# Altium schematic sheet MCH_FPGA_Bank_0_CFG.SchDoc: Metlino
size 420 x 297 mm; CheckedBy: P.Kulik,T.Przywozki,W.Ruclo; Author: G.Kasprowicz; CompanyName: WUT ISE; DrawnBy: G.Kasprowicz; Organization: WUT ISE; Address1: PW ISE; Address2: Nowowiejska 15/19 00-665 Warsaw; Address3: gkasprow@gmail.com; DocumentNumber: 2; Revision: 2; SheetNumber: 2; SheetTotal: 29; ModifiedBy: -; CheckedDate: -; Title2: FPGA Bank0 & configuration; DivGrp: WUT ISE; Designer: G.Kasprowicz; ModifiedDate: -; ProjectName: Sensor Box
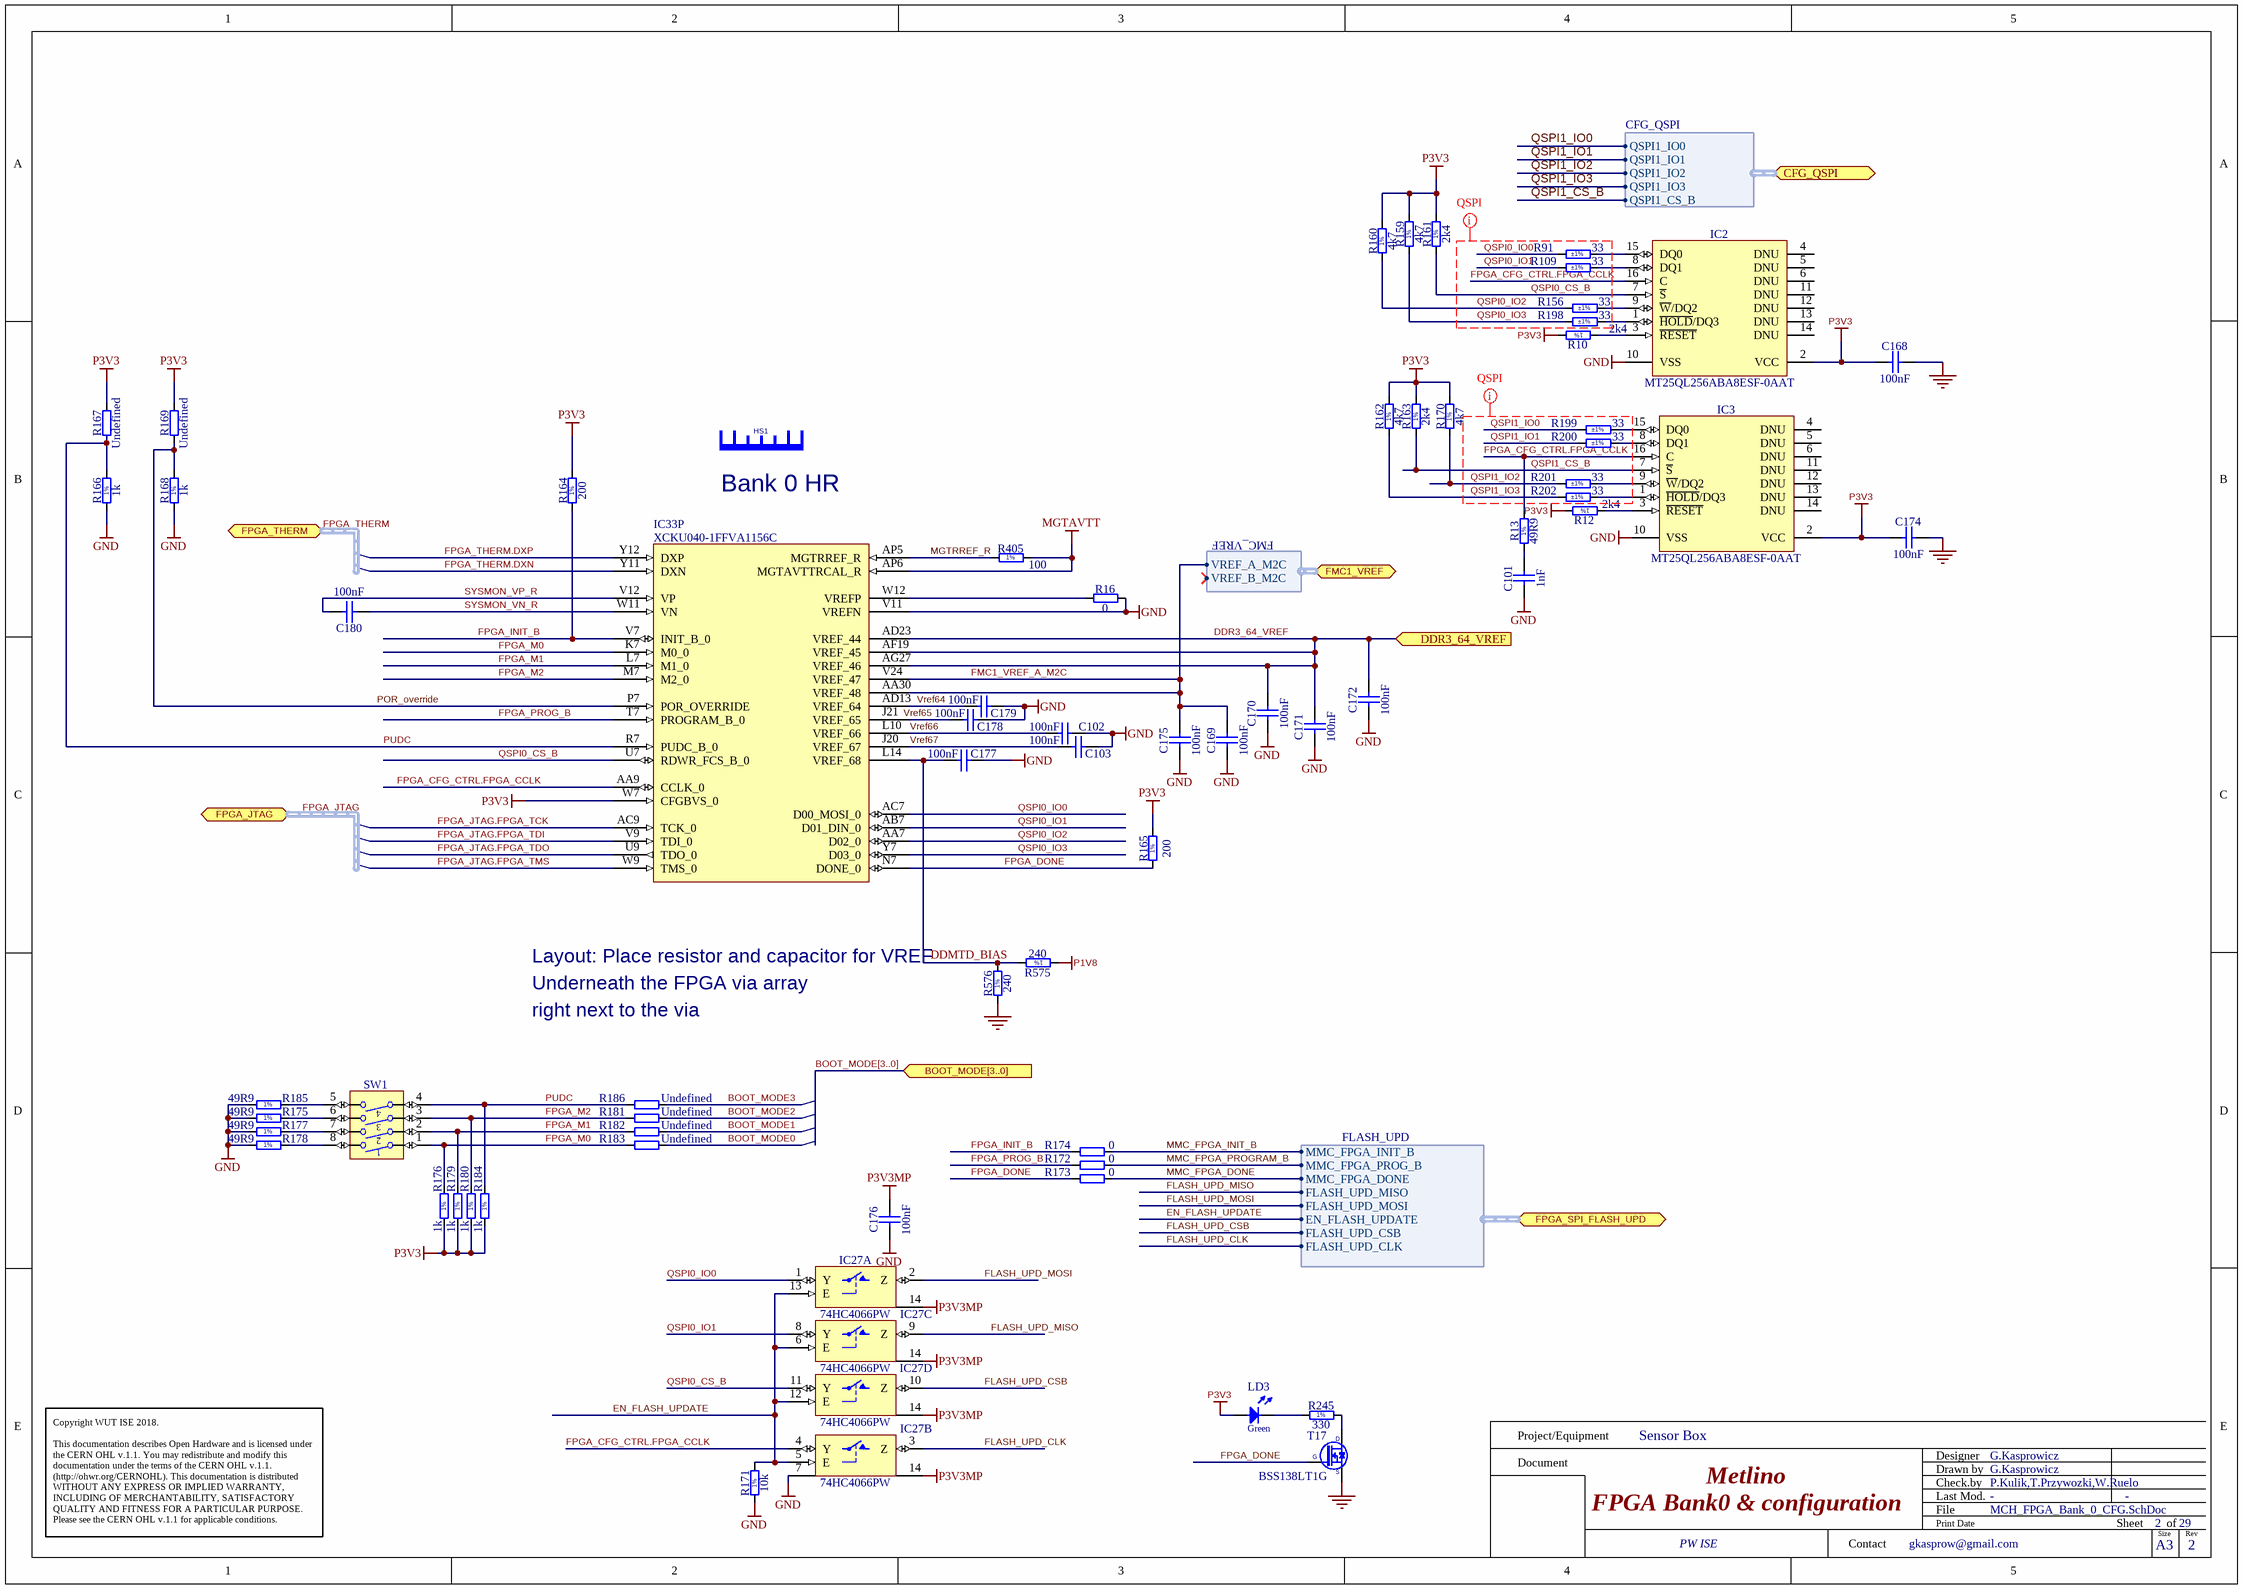
[diagram p0: MCH_FPGA_Bank_0_CFG.SchDoc]

## Parts
C101  1nF  [CAPC1005X55N]
C102  100nF  [CAPC0603X33N]
C103  100nF  [CAPC0603X33N]
C168  100nF  [CAPC0603X33N]
C169  100nF  [CAPC0603X33N]
C170  100nF  [CAPC0603X33N]
C171  100nF  [CAPC0603X33N]
C172  100nF  [CAPC0603X33N]
C174  100nF  [CAPC0603X33N]
C175  100nF  [CAPC0603X33N]
C176  100nF  [CAPC0603X33N]
C177  100nF  [CAPC0603X33N]
C178  100nF  [CAPC0603X33N]
C179  100nF  [CAPC0603X33N]
C180  100nF  [CAPC0603X33N]
HS1  Heat Sink No Pad  [HSINK_WAKEFIELD_SKV585811-CU]  (value not drawn)
IC2  MT25QL256ABA8ESF-0AAT  [SOIC127P1030X265-16N]
IC3  MT25QL256ABA8ESF-0AAT  [SOIC127P1030X265-16N]
IC27  74HC4066PW  [SOP65P640X110-14N]  (parts A,B,C,D of 4)
IC33  XCKU040-1FFVA1156C  [BGA1156C100P34X34_3500X3500X350]  (part P of 22)
LD3  Green  [LED_AVAGO_HSME-C120]
R10  2k4  [RESC1005X40N]
R12  2k4  [RESC1005X40N]
R13  49R9  [RESC1005X40N]
R16  0  [RESC1005X40N]
R91  33  Tolerance: ±1%  [RESC1005X40N]
R109  33  Tolerance: ±1%  [RESC1005X40N]
R156  33  Tolerance: ±1%  [RESC1005X40N]
R159  4k7  [RESC1005X40N]
R160  4k7  [RESC1005X40N]
R161  2k4  [RESC1005X40N]
R162  4k7  [RESC1005X40N]
R163  2k4  [RESC1005X40N]
R164  200  [RESC1005X40N]
R165  200  [RESC1005X40N]
R166  1k  [RESC1005X40N]
R167  Undefined  [RESC1005X40N]
R168  1k  [RESC1005X40N]
R169  Undefined  [RESC1005X40N]
R170  4k7  [RESC1005X40N]
R171  10k  [RESC1005X40N]
R172  0  [RESC1005X40N]
R173  0  [RESC1005X40N]
R174  0  [RESC1005X40N]
R175  49R9  [RESC1005X40N]
R176  1k  [RESC1005X40N]
R177  49R9  [RESC1005X40N]
R178  49R9  [RESC1005X40N]
R179  1k  [RESC1005X40N]
R180  1k  [RESC1005X40N]
R181  Undefined  [RESC1005X40N]
R182  Undefined  [RESC1005X40N]
R183  Undefined  [RESC1005X40N]
R184  1k  [RESC1005X40N]
R185  49R9  [RESC1005X40N]
R186  Undefined  [RESC1005X40N]
R198  33  Tolerance: ±1%  [RESC1005X40N]
R199  33  Tolerance: ±1%  [RESC1005X40N]
R200  33  Tolerance: ±1%  [RESC1005X40N]
R201  33  Tolerance: ±1%  [RESC1005X40N]
R202  33  Tolerance: ±1%  [RESC1005X40N]
R245  330  [RESC1005X40N]
R405  100  [RESC0603X28N]
R575  240  [RESC1005X40N]
R576  240  [RESC1005X40N]
SW1  Switch  [SW_TYCO_1571983-4]  (value not drawn)
T17  BSS138LT1G  [SOT95P240X110-3N]

## Ports
BOOT_MODE[3..0] (in), CFG_QSPI (bidir, harness CFG_QSPI), DDR3_64_VREF (in), FMC1_VREF (bidir, harness FMC_VREF), FPGA_JTAG (bidir, harness FPGA_JTAG), FPGA_SPI_FLASH_UPD (bidir, harness FLASH_UPD), FPGA_THERM (bidir, harness FPGA_THERM)

## Harnesses
CFG_QSPI: QSPI1_IO0, QSPI1_IO1, QSPI1_IO2, QSPI1_IO3, QSPI1_CS_B
FMC_VREF: VREF_A_M2C, VREF_B_M2C
FLASH_UPD: MMC_FPGA_DONE, EN_FLASH_UPDATE, MMC_FPGA_INIT_B, FLASH_UPD_CLK, FLASH_UPD_CSB, FLASH_UPD_MISO, FLASH_UPD_MOSI, MMC_FPGA_PROG_B

## Nets
GND: C101.1 C102.2 C103.2 C168.1 C169.2 C170.2 C171.2 C172.2 C174.1 C175.2 C176.1 C177.2 C178.2 C179.2 IC2.10(VSS) IC3.10(VSS) IC27.7(GND) IC33.V11(VREFN) R16.2 R166.1 R168.1 R171.1 R175.1 R177.1 R178.1 R185.1 R576.1 T17.2(S)
MGTAVTT: IC33.AP6(MGTAVTTRCAL_R) R405.2
P1V8: R575.1
P3V3: C168.2 C174.2 IC2.2(VCC) IC3.2(VCC) IC33.W7(CFGBVS_0) LD3.2(A) R10.2 R12.2 R159.2 R160.2 R161.2 R162.2 R163.2 R164.2 R165.2 R167.2 R169.2 R170.2 R176.1 R179.1 R180.1 R184.1
P3V3MP: C176.2 IC27.14(VCC)
BOOT_MODE0: R183.2
BOOT_MODE1: R182.2
BOOT_MODE2: R181.2
BOOT_MODE3: R186.2
DDMTD_BIAS: C177.1 IC33.L14(VREF_68) R575.2 R576.2
DDR3_64_VREF: C170.1 C171.1 C172.1 IC33.AD23(VREF_44) IC33.AF19(VREF_45) IC33.AG27(VREF_46) ; port DDR3_64_VREF
EN_FLASH_UPDATE: IC27.5(E) IC27.6(E) IC27.12(E) IC27.13(E) R171.2 ; port FPGA_SPI_FLASH_UPD.EN_FLASH_UPDATE
FLASH_UPD_CLK: IC27.3(Z) ; port FPGA_SPI_FLASH_UPD.FLASH_UPD_CLK
FLASH_UPD_CSB: IC27.10(Z) ; port FPGA_SPI_FLASH_UPD.FLASH_UPD_CSB
FLASH_UPD_MISO: IC27.9(Z) ; port FPGA_SPI_FLASH_UPD.FLASH_UPD_MISO
FLASH_UPD_MOSI: IC27.2(Z) ; port FPGA_SPI_FLASH_UPD.FLASH_UPD_MOSI
FMC1_VREF_A_M2C: C169.1 C175.1 IC33.AA30(VREF_48) IC33.V24(VREF_47) ; port FMC1_VREF.VREF_A_M2C
FPGA_CFG_CTRL.FPGA_CCLK: IC2.16(C) IC3.16(C) IC27.4(Y) IC33.AA9(CCLK_0) R13.2
FPGA_DONE: IC33.N7(DONE_0) R165.1 R173.1 T17.1(G)
FPGA_INIT_B: IC33.V7(INIT_B_0) R164.1 R174.1
FPGA_JTAG.FPGA_TCK: IC33.AC9(TCK_0)
FPGA_JTAG.FPGA_TDI: IC33.V9(TDI_0)
FPGA_JTAG.FPGA_TDO: IC33.U9(TDO_0)
FPGA_JTAG.FPGA_TMS: IC33.W9(TMS_0)
FPGA_M0: IC33.K7(M0_0) R176.2 R183.1 SW1.1
FPGA_M1: IC33.L7(M1_0) R179.2 R182.1 SW1.2
FPGA_M2: IC33.M7(M2_0) R180.2 R181.1 SW1.3
FPGA_PROG_B: IC33.T7(PROGRAM_B_0) R172.1
FPGA_THERM.DXN: IC33.Y11(DXN)
FPGA_THERM.DXP: IC33.Y12(DXP)
MGTRREF_R: IC33.AP5(MGTRREF_R) R405.1
MMC_FPGA_DONE: R173.2 ; port FPGA_SPI_FLASH_UPD.MMC_FPGA_DONE
MMC_FPGA_INIT_B: R174.2 ; port FPGA_SPI_FLASH_UPD.MMC_FPGA_INIT_B
MMC_FPGA_PROGRAM_B: R172.2 ; port FPGA_SPI_FLASH_UPD.MMC_FPGA_PROG_B
POR_override: IC33.P7(POR_OVERRIDE) R168.2 R169.1
PUDC: IC33.R7(PUDC_B_0) R166.2 R167.1 R184.2 R186.1 SW1.4
QSPI0_CS_B: IC2.7(~{S}) IC27.11(Y) IC33.U7(RDWR_FCS_B_0) R161.1
QSPI0_IO0: IC27.1(Y) IC33.AC7(D00_MOSI_0) R91.1
QSPI0_IO1: IC27.8(Y) IC33.AB7(D01_DIN_0) R109.1
QSPI0_IO2: IC33.AA7(D02_0) R156.1 R160.1
QSPI0_IO3: IC33.Y7(D03_0) R159.1 R198.1
QSPI1_CS_B: IC3.7(~{S}) R163.1 ; port CFG_QSPI.QSPI1_CS_B
QSPI1_IO0: R199.1 ; port CFG_QSPI.QSPI1_IO0
QSPI1_IO1: R200.1 ; port CFG_QSPI.QSPI1_IO1
QSPI1_IO2: R170.1 R201.1 ; port CFG_QSPI.QSPI1_IO2
QSPI1_IO3: R162.1 R202.1 ; port CFG_QSPI.QSPI1_IO3
SYSMON_VN_R: C180.1 IC33.W11(VN)
SYSMON_VP_R: C180.2 IC33.V12(VP)
Vref64: C179.1 IC33.AD13(VREF_64)
Vref66: C102.1 IC33.L10(VREF_66)
Vref67: C103.1 IC33.J20(VREF_67)
NetC101_2: C101.2 R13.1
NetC178_1: C178.1 IC33.J21(VREF_65)
NetIC2_1: IC2.1(~{HOLD}/DQ3) R198.2
NetIC2_3: IC2.3(~{RESET}) R10.1
NetIC2_8: IC2.8(DQ1) R109.2
NetIC2_9: IC2.9(~{W}/DQ2) R156.2
NetIC2_15: IC2.15(DQ0) R91.2
NetIC3_1: IC3.1(~{HOLD}/DQ3) R202.2
NetIC3_3: IC3.3(~{RESET}) R12.1
NetIC3_8: IC3.8(DQ1) R200.2
NetIC3_9: IC3.9(~{W}/DQ2) R201.2
NetIC3_15: IC3.15(DQ0) R199.2
NetIC33_W12: IC33.W12(VREFP) R16.1
NetLD3_1: LD3.1(C) R245.1
NetR175_2: R175.2 SW1.6
NetR177_2: R177.2 SW1.7
NetR178_2: R178.2 SW1.8
NetR185_2: R185.2 SW1.5
NetR245_2: R245.2 T17.3(D)

Not connected (* = marked no-connect by the designer): IC2 4(DNU) 5(DNU) 6(DNU) 11(DNU) 12(DNU) 13(DNU) 14(DNU); IC3 4(DNU) 5(DNU) 6(DNU) 11(DNU) 12(DNU) 13(DNU) 14(DNU)

## Buses and harness runs
bus BOOT_MODE[3..0] = port BOOT_MODE[3..0]
harness FPGA_JTAG = port FPGA_JTAG
harness FPGA_THERM = port FPGA_THERM

## Layout directives
net class QSPI: FPGA_CFG_CTRL.FPGA_CCLK, QSPI0_CS_B, QSPI0_IO0, QSPI0_IO1, QSPI0_IO2, QSPI0_IO3, QSPI1_CS_B, QSPI1_IO0, QSPI1_IO1, QSPI1_IO2, QSPI1_IO3

## Notes on the sheet
- (near HS1) Bank 0 HR
- Underneath the FPGA via array
- (near R576) Layout: Place resistor and capacitor for VREF
- right next to the via
- Labels drawn without touching a wire or pin: Vref65
- Project/Equipment
- Document
- Designer
- Drawn by
- Check.by
- Copyright WUT ISE 2018.
  This documentation describes Open Hardware and is licensed under the CERN OHL v.1.1. You may redistribute and modify this documentation under the terms of the CERN OHL v.1.1. (http://ohwr.org/CERNOHL). This documentation is distributed WITHOUT ANY EXPRESS OR IMPLIED WARRANTY, INCLUDING OF MERCHANTABILITY, SATISFACTORY QUALITY AND FITNESS FOR A PARTICULAR PURPOSE. Please see the CERN OHL v.1.1 for applicable conditions.
- Contact
- File
- Last Mod.
- Print Date
- Sheet
- Size
- A3
- of
- Rev
- (in symbol R0201_100R_1%_0.05W_200PPM) 1%
- (in symbol R0402_1K_1%_0.0625W_100PPM) 1%
- (in symbol R0402_2K4_1%_0.0625W_100PPM) 1%
- (in symbol R0402_4K7_1%_0.0625W_100PPM) 1%
- (in symbol R0402_10K_1%_0.0625W_100PPM) 1%
- (in symbol R0402_49R9_1%_0.0625W_100PPM) 1%
- (in symbol R0402_200R_1%_0.0625W_100PPM) 1%
- (in symbol R0402_240R_1%_0.0625W_100PPM) 1%
- (in symbol R0402_330R_1%_0.0625W_100PPM) 1%

## Library data of the parts
C101 = CC0402_1NF_50V_10%_X7R: Non-polarised capacitor; Manufacturer: GENERIC; Part Description: SMD Multilayer Chip Ceramic Capacitor; Manufacturer1 Part Number: 223858715623; Tolerance: ±10%; Voltage: 50V; TC: X7R; Manufacturer Part Number: CC0402_1NF_50V_10%_X7R; Part Number: CC0402_1NF_50V_10%_X7R; Value: 1nF; Component Kind: Standard; Component Type: Standard; Pin Count: 2; Status: Not Recommended; Case: 0402; Mounted: Yes; Socket: No; SMD: Yes; Sense: No; Manufacturer1 Example: PHYCOMP; Manufacturer1 ComponentHeight: 0.55mm; HelpURL: \\cern.ch\dfs\Applications\Altium\Datasheets\CC0402_X7R_PHYCOMP.pdf; Author: CERN DEM JLC; CreateDate: 03.12.2007; LatestRevisionDate: 03.12.2007
C102 C103 C168-C172 C174 C175 C177-C180 = CC0201_100NF_6.3V_10%_X5R: Non-polarised capacitor; Manufacturer: GENERIC; Part Description: SMD Multilayer Chip Ceramic Capacitor; Manufacturer1 Part Number: 02016D104KAT2A; Tolerance: ±10%; Voltage: 6.3V; TC: X5R; Manufacturer Part Number: CC0201_100NF_6.3V_10%_X5R; Part Number: CC0201_100NF_6.3V_10%_X5R; Value: 100nF; Component Kind: Standard; Component Type: Standard; Pin Count: 2; Status: Not Recommended; Case: 0201; Mounted: Yes; Socket: No; SMD: Yes; Sense: No; Manufacturer1 Example: AVX; Manufacturer1 ComponentHeight: 0.33mm; HelpURL: \\cern.ch\dfs\Applications\Altium\Datasheets\CC0201_X5R_AVX.pdf; Author: CERN DEM JLC; CreateDate: 03.12.2007; LatestRevisionDate: 03.12.2007
C176 = CC0201_100NF_6.3V_10%_X5R: Non-polarised capacitor; Manufacturer: GENERIC; Manufacturer1 Part Number: 02016D104KAT2A; Part Description: SMD Multilayer Chip Ceramic Capacitor; TC: X5R; Tolerance: ±10%; Voltage: 6.3V; Author: CERN DEM JLC; Case: 0201; Component Kind: Standard; Component Type: Standard; CreateDate: 03.12.2007; HelpURL: \\cern.ch\dfs\Applications\Altium\Datasheets\CC0201_X5R_AVX.pdf; LatestRevisionDate: 03.12.2007; Manufacturer Part Number: CC0201_100NF_6.3V_10%_X5R; Manufacturer1 ComponentHeight: 0.33mm; Manufacturer1 Example: AVX; Mounted: Yes; Part Number: CC0201_100NF_6.3V_10%_X5R; Pin Count: 2; SMD: Yes; Socket: No; Status: Not Recommended; Value: 100nF; Sense: No
HS1 = HSINK_WAKEFIELD_SKV585811-CU: Heat Sink Without Pad; Part Description: Copper Skived Fin Heat Sink, Rth: 7.70°C/W, with Plastic Push Pin Attachement; Manufacturer: WAKEFIELD-VETTE; PressFit: No; Part Number: HSINK_WAKEFIELD_SKV585811-CU; Component Kind: Accessories; Component Type: Standard; Pin Count: 0; PackageDescription: Copper Skived Fin Heat Sink; Body 58mm x 58mm Height 11mm; Mounted: Yes; Socket: No; SMD: No; Sense: No; Status: None; Manufacturer Part Number: SKV585811-CU; ComponentHeight: 11mm; HelpURL: \\cern.ch\dfs\Applications\Altium\Datasheets\HSINK_WAKEFIELD_SKV585811.pdf; Author: CERN DEM JMW; CreateDate: 26.11.2019; LatestRevisionDate: 26.11.2019
IC2 IC3 = MT25QL256ABA8ESF-0AAT: 256Mbit (32MB), 2.7V-3.6V, Multiple I/O Serial NOR Flash Memory,with Reset# & Hold#; Part Description: 256Mbit (32MB), 2.7V-3.6V, Multiple I/O Serial NOR Flash Memory,with Reset# & Hold# (Automotive grade AEC-Q100); Manufacturer: MICRON TECHNOLOGY; PressFit: No; Bonding: No; Part Number: MT25QL256ABA8ESF-0AAT; Component Kind: Standard; Component Type: Standard; Device: MT25QL256ABA8ESF-0AAT; PackageDescription: SOIC 16, Pitch 1.27mm - Body 7.5x10.3mm, IPC Medium Density; Manufacturer Part Number: MT25QL256ABA8ESF-0AAT; Pin Count: 16; Case: SOIC16; Mounted: Yes; Socket: No; SMD: Yes; Sense: No; ComponentHeight: 2.65mm; HelpURL: \\cern.ch\dfs\Applications\Altium\Datasheets\MT25QL256ABA8ESF-0AAT.pdf; Author: CERN DEM JLC; CreateDate: 05.11.2018; LatestRevisionDate: 05.11.2018
IC27 = 74HC4066PW: Manufacturer: NXP SEMICONDUCTORS; Part Description: Quad Single-Pole Single-Throw Analog Switch; PressFit: No; Bonding: No; Manufacturer Part Number: 74HC4066PW; PackageDescription: SOP, 14-Leads, Body 4.4x5mm (max), Pitch 0.65mm, IPC Medium Density; Part Number: 74HC4066PW; Component Kind: Standard; Component Type: Standard; Device: 74HC4066PW; Pin Count: 14; Case: TSSOP14; Mounted: Yes; Socket: No; SMD: Yes; Sense: No; ComponentHeight: 1.1mm; Author: CERN DEM JLC; HelpURL: \\cern.ch\dfs\Applications\Altium\Datasheets\74HC4066PW.pdf; CreateDate: 19.11.2014; LatestRevisionDate: 19.11.2014
IC33 = XCKU040-1FFVA1156C: Kintex UltraScale FPGA, 520 I/O, 530K Cells, 1156-Ball BGA, Speed Grade 1, Commercial Grade; Manufacturer: XILINX; Part Description: Kintex UltraScale, 40 DLL I/O, 416 HP I/O, 104 HR I/O, 1156-Pin BGA, Speed Grade 1, Commercial Grade; PressFit: No; Bonding: No; PackageDescription: BGA, 1.00mm Pitch, Square; 1156 Pin, 34 Columns X 34 Rows, Body 35.00mm X 35.00mm X 3.50mm H, IPC Medium Density; Part Number: XCKU040-1FFVA1156C; Component Kind: Standard; Component Type: Standard; Device: XCKU040-1FFVA1156C; Manufacturer Part Number: XCKU040-1FFVA1156C; Pin Count: 1156; Case: BGA1156; Mounted: Yes; Socket: No; SMD: Yes; Sense: No; ComponentHeight: 3.5mm; HelpURL: \\cern.ch\dfs\Applications\Altium\Datasheets\XCKU040-1FFVA1156C.pdf; ComponentLink1URL: \\cern.ch\dfs\Applications\Altium\Datasheets\XCKU040-1FFVA1156C_Package-Pinout.pdf; ComponentLink1Description: Package/Pinout; Author: CERN DEM CA; CreateDate: 16.08.2016; LatestRevisionDate: 16.08.2016
LD3 = LED_AVAGO_HSME-C120: LED Green 1C 2A; Manufacturer: AVAGO TECHNOLOGIES; Part Description: High Performance Right Angle Chip Green LED; PressFit: No; Bonding: No; Manufacturer Part Number: HSME-C120; PackageDescription: Green Chip LED, 2-Leads, Body 1.7x1.1mm, Side Emitting Package; Part Number: LED_AVAGO_HSME-C120; Component Kind: Standard; Component Type: Standard; Color: Green; Pin Count: 2; Mounted: Yes; Socket: No; SMD: Yes; Sense: No; ComponentHeight: 0.7mm; HelpURL: \\cern.ch\dfs\Applications\Altium\Datasheets\LED_AVAGO_HSME-C120.pdf; ComponentLink1URL: \\cern.ch\dfs\Applications\Altium\Datasheets\LED_AVAGO_HSME-C110_DESIGN-GUIDE.pdf; ComponentLink1Description: Design Guide; Author: CERN DEM JMW; CreateDate: 22.07.2009; LatestRevisionDate: 20.06.2012
R10 R12 R161 R163 = R0402_2K4_1%_0.0625W_100PPM: Resistor - 1%; Manufacturer: GENERIC; Part Description: General Purpose Thick Film Chip Resistor; Manufacturer1 Part Number: 232270672402L; TC: ±100ppm/°C; PressFit: No; Manufacturer Part Number: R0402_2K4_1%_0.0625W_100PPM; Part Number: R0402_2K4_1%_0.0625W_100PPM; Tolerance: ±1%; Value: 2k4; Component Kind: Standard; Component Type: Standard; Pin Count: 2; Status: Not Recommended; Power: 0.0625W; Case: 0402; Mounted: Yes; Sense: No; Socket: No; SMD: Yes; Manufacturer1 Example: YAGEO PHYCOMP; Manufacturer1 ComponentHeight: 0.4mm; HelpURL: \\cern.ch\dfs\Applications\Altium\Datasheets\R0402_Phycomp_RC0402.pdf; Author: CERN DEM JLC; CreateDate: 03.12.2007; LatestRevisionDate: 17.10.2012
R13 R175 R177 R178 R185 = R0402_49R9_1%_0.0625W_100PPM: Resistor - 1%; Manufacturer: GENERIC; Part Description: General Purpose Thick Film Chip Resistor; Manufacturer1 Part Number: 232270674999L or RC0402FR-0749R9L; TC: ±100ppm/°C; PressFit: No; Manufacturer Part Number: R0402_49R9_1%_0.0625W_100PPM; Part Number: R0402_49R9_1%_0.0625W_100PPM; Tolerance: ±1%; Value: 49R9; Component Kind: Standard; Component Type: Standard; Pin Count: 2; Status: Not Recommended; Power: 0.0625W; Case: 0402; Mounted: Yes; Sense: No; Socket: No; SMD: Yes; Manufacturer1 Example: YAGEO PHYCOMP; Manufacturer1 ComponentHeight: 0.4mm; HelpURL: \\cern.ch\dfs\Applications\Altium\Datasheets\R0402_Phycomp_RC0402.pdf; Author: CERN DEM JLC; CreateDate: 24.10.2012; LatestRevisionDate: 24.10.2012
R16 R172-R174 = R0402_0R_JUMPER: Resistor; Manufacturer: GENERIC; Part Description: 1A (0.05R Max DC Resistance) Zero Ohm Jumper; Manufacturer1 Part Number: 232270591001L; PressFit: No; Manufacturer Part Number: R0402_0R_JUMPER; Part Number: R0402_0R_JUMPER; Value: 0; Component Kind: Standard; Component Type: Standard; Pin Count: 2; Status: Not Recommended; Case: 0402; Mounted: Yes; Sense: No; Socket: No; SMD: Yes; Manufacturer1 Example: YAGEO PHYCOMP; Manufacturer1 ComponentHeight: 0.4mm; HelpURL: \\cern.ch\dfs\Applications\Altium\Datasheets\R0402_Phycomp_RC0402.pdf; Author: CERN DEM JLC; CreateDate: 03.12.2007; LatestRevisionDate: 17.10.2012
R91 R109 R156 R198-R202 = R0402_33R_1%_0.0625W_100PPM: Resistor - 1%; Part Description: General Purpose Thick Film Chip Resistor; Manufacturer: GENERIC; Manufacturer1 Part Number: 232270673309L; TC: ±100ppm/°C; PressFit: No; Part Number: R0402_33R_1%_0.0625W_100PPM; Component Kind: Standard; Component Type: Standard; Pin Count: 2; Value: 33; Status: Not Recommended; Power: 0.0625W; Manufacturer Part Number: R0402_33R_1%_0.0625W_100PPM; Case: 0402; Mounted: Yes; Sense: No; Socket: No; SMD: Yes; Manufacturer1 Example: YAGEO PHYCOMP; Manufacturer1 ComponentHeight: 0.4mm; HelpURL: \\cern.ch\dfs\Applications\Altium\Datasheets\R0402_Phycomp_RC0402.pdf; Author: CERN DEM JLC; CreateDate: 03.12.2007; LatestRevisionDate: 17.10.2012
R159 R160 R162 R170 = R0402_4K7_1%_0.0625W_100PPM: Resistor - 1%; Manufacturer: GENERIC; Part Description: General Purpose Thick Film Chip Resistor; Manufacturer1 Part Number: 232270674702L; TC: ±100ppm/°C; PressFit: No; Manufacturer Part Number: R0402_4K7_1%_0.0625W_100PPM; Part Number: R0402_4K7_1%_0.0625W_100PPM; Tolerance: ±1%; Value: 4k7; Component Kind: Standard; Component Type: Standard; Pin Count: 2; Status: Not Recommended; Power: 0.0625W; Case: 0402; Mounted: Yes; Sense: No; Socket: No; SMD: Yes; Manufacturer1 Example: YAGEO PHYCOMP; Manufacturer1 ComponentHeight: 0.4mm; HelpURL: \\cern.ch\dfs\Applications\Altium\Datasheets\R0402_Phycomp_RC0402.pdf; Author: CERN DEM JLC; CreateDate: 03.12.2007; LatestRevisionDate: 17.10.2012
R164 R165 = R0402_200R_1%_0.0625W_100PPM: Resistor - 1%; Manufacturer: GENERIC; Part Description: General Purpose Thick Film Chip Resistor; Manufacturer1 Part Number: 232270672001L; TC: ±100ppm/°C; PressFit: No; Manufacturer Part Number: R0402_200R_1%_0.0625W_100PPM; Part Number: R0402_200R_1%_0.0625W_100PPM; Tolerance: ±1%; Value: 200; Component Kind: Standard; Component Type: Standard; Pin Count: 2; Status: Not Recommended; Power: 0.0625W; Case: 0402; Mounted: Yes; Sense: No; Socket: No; SMD: Yes; Manufacturer1 Example: YAGEO PHYCOMP; Manufacturer1 ComponentHeight: 0.4mm; HelpURL: \\cern.ch\dfs\Applications\Altium\Datasheets\R0402_Phycomp_RC0402.pdf; Author: CERN DEM JLC; CreateDate: 03.12.2007; LatestRevisionDate: 17.10.2012
R166 R168 R176 R179 R180 R184 = R0402_1K_1%_0.0625W_100PPM: Resistor - 1%; Manufacturer: GENERIC; Part Description: General Purpose Thick Film Chip Resistor; Manufacturer1 Part Number: 232270671002L; TC: ±100ppm/°C; PressFit: No; Manufacturer Part Number: R0402_1K_1%_0.0625W_100PPM; Part Number: R0402_1K_1%_0.0625W_100PPM; Tolerance: ±1%; Value: 1k; Component Kind: Standard; Component Type: Standard; Pin Count: 2; Status: Not Recommended; Power: 0.0625W; Case: 0402; Mounted: Yes; Sense: No; Socket: No; SMD: Yes; Manufacturer1 Example: YAGEO PHYCOMP; Manufacturer1 ComponentHeight: 0.4mm; HelpURL: \\cern.ch\dfs\Applications\Altium\Datasheets\R0402_Phycomp_RC0402.pdf; Author: CERN DEM JLC; CreateDate: 03.12.2007; LatestRevisionDate: 17.10.2012
R167 R169 R181-R183 R186 = R0402_NO-VALUE: Resistor; Part Description: Reserved Footprint For a 0402 (1005) Chip Resistor; PressFit: No; Mounted: No; Manufacturer Part Number: R0402_NO-VALUE; Manufacturer: Undefined; Part Number: R0402_NO-VALUE; Value: Undefined; Component Kind: Standard; Component Type: Standard; Pin Count: 2; Status: None; Case: 0402; Sense: No; Socket: No; SMD: Yes; Manufacturer1 Example: Undefined; Manufacturer1 Part Number: Undefined; Manufacturer1 ComponentHeight: Undefined; HelpURL: Undefined; Author: CERN DEM JLC; CreateDate: 03.12.2007; LatestRevisionDate: 13.03.2008
R171 = R0402_10K_1%_0.0625W_100PPM: Resistor - 1%; Manufacturer: GENERIC; Part Description: General Purpose Thick Film Chip Resistor; Manufacturer1 Part Number: 232270671003L; TC: ±100ppm/°C; PressFit: No; Manufacturer Part Number: R0402_10K_1%_0.0625W_100PPM; Part Number: R0402_10K_1%_0.0625W_100PPM; Tolerance: ±1%; Value: 10k; Component Kind: Standard; Component Type: Standard; Pin Count: 2; Status: Not Recommended; Power: 0.0625W; Case: 0402; Mounted: Yes; Sense: No; Socket: No; SMD: Yes; Manufacturer1 Example: YAGEO PHYCOMP; Manufacturer1 ComponentHeight: 0.4mm; HelpURL: \\cern.ch\dfs\Applications\Altium\Datasheets\R0402_Phycomp_RC0402.pdf; Author: CERN DEM JLC; CreateDate: 03.12.2007; LatestRevisionDate: 17.10.2012
R245 = R0402_330R_1%_0.0625W_100PPM: Resistor - 1%; Manufacturer: GENERIC; Part Description: General Purpose Thick Film Chip Resistor; Manufacturer1 Part Number: 232270673301L; TC: ±100ppm/°C; PressFit: No; Manufacturer Part Number: R0402_330R_1%_0.0625W_100PPM; Part Number: R0402_330R_1%_0.0625W_100PPM; Tolerance: ±1%; Value: 330; Component Kind: Standard; Component Type: Standard; Pin Count: 2; Status: Not Recommended; Power: 0.0625W; Case: 0402; Mounted: Yes; Sense: No; Socket: No; SMD: Yes; Manufacturer1 Example: YAGEO PHYCOMP; Manufacturer1 ComponentHeight: 0.4mm; HelpURL: \\cern.ch\dfs\Applications\Altium\Datasheets\R0402_Phycomp_RC0402.pdf; Author: CERN DEM JLC; CreateDate: 03.12.2007; LatestRevisionDate: 17.10.2012
R405 = R0201_100R_1%_0.05W_200PPM: Resistor - 1%; Manufacturer: GENERIC; Part Description: Thick Film Chip Resistor; Manufacturer1 Part Number: CRCW0201100RFNED; Power: 0.05W; TC: ±200ppm/°C; PressFit: No; Manufacturer Part Number: R0201_100R_1%_0.05W_200PPM; Part Number: R0201_100R_1%_0.05W_200PPM; Tolerance: ±1%; Value: 100; Component Kind: Standard; Component Type: Standard; Pin Count: 2; Status: Not Recommended; Case: 0201; Mounted: Yes; Sense: No; Socket: No; SMD: Yes; Manufacturer1 Example: VISHAY; Manufacturer1 ComponentHeight: 0.27mm; HelpURL: \\cern.ch\dfs\Applications\Altium\Datasheets\R0201_VISHAY_CRCW0201 e3.pdf; Author: CERN DEM JLC; CreateDate: 13.11.2014; LatestRevisionDate: 13.11.2014
R575 R576 = R0402_240R_1%_0.0625W_100PPM: Resistor - 1%; Manufacturer: GENERIC; Part Description: General Purpose Thick Film Chip Resistor; Manufacturer1 Part Number: 232270672401L; TC: ±100ppm/°C; PressFit: No; Manufacturer Part Number: R0402_240R_1%_0.0625W_100PPM; Part Number: R0402_240R_1%_0.0625W_100PPM; Tolerance: ±1%; Value: 240; Component Kind: Standard; Component Type: Standard; Pin Count: 2; Status: Not Recommended; Power: 0.0625W; Case: 0402; Mounted: Yes; Sense: No; Socket: No; SMD: Yes; Manufacturer1 Example: YAGEO PHYCOMP; Manufacturer1 ComponentHeight: 0.4mm; HelpURL: \\cern.ch\dfs\Applications\Altium\Datasheets\R0402_Phycomp_RC0402.pdf; Author: CERN DEM JLC; CreateDate: 03.12.2007; LatestRevisionDate: 17.10.2012
SW1 = SW_TYCO_1571983-4: 4 Ways SPST DIP Switch; Manufacturer Part Number: 1571983-4 or GDH04S04; Manufacturer: TYCO; Part Description: 4 Way SPST SMD DIP Switch, Latched, Contact Rating 0.025A 24VDC; PressFit: No; PackageDescription: Pitch 1.27mm,  Body 6.2x6.2mm, 4 Ways SPST Surface-Mount DIP Switch, TYCO GDH Series; Part Number: SW_TYCO_1571983-4; Component Kind: Standard; Component Type: Standard; Pin Count: 8; Family: Switch; Mounted: Yes; Socket: No; SMD: Yes; Sense: No; Status: None; ComponentHeight: 2.31mm; HelpURL: \\cern.ch\dfs\Applications\Altium\Datasheets\SW_TYCO_1571983-4.pdf; Author: CERN DEM JLC; CreateDate: 08.01.2009; LatestRevisionDate: 08.01.2009
T17 = BSS138LT1G: N-CHANNEL MOSFET WITH DIODE; Manufacturer: ON SEMICONDUCTOR; Part Description: 50V 200mA N-Channel Enhancement Mode Field-Effect Transistor; PressFit: No; Bonding: No; Manufacturer Part Number: BSS138LT1G; PackageDescription: SOT23 3-Leads, Pitch 0.95mm - Body 1.4x3mm, IPC Medium Density; Part Number: BSS138LT1G; Component Kind: Standard; Component Type: Standard; Device: BSS138LT1G; Pin Count: 3; Case: SOT23-3; Mounted: Yes; Socket: No; SMD: Yes; Sense: No; ComponentHeight: 1.11mm; HelpURL: \\cern.ch\dfs\Applications\Altium\Datasheets\BSS138LT1G.pdf; Author: CERN DEM JLC; CreateDate: 23.03.2009; LatestRevisionDate: 23.03.2009